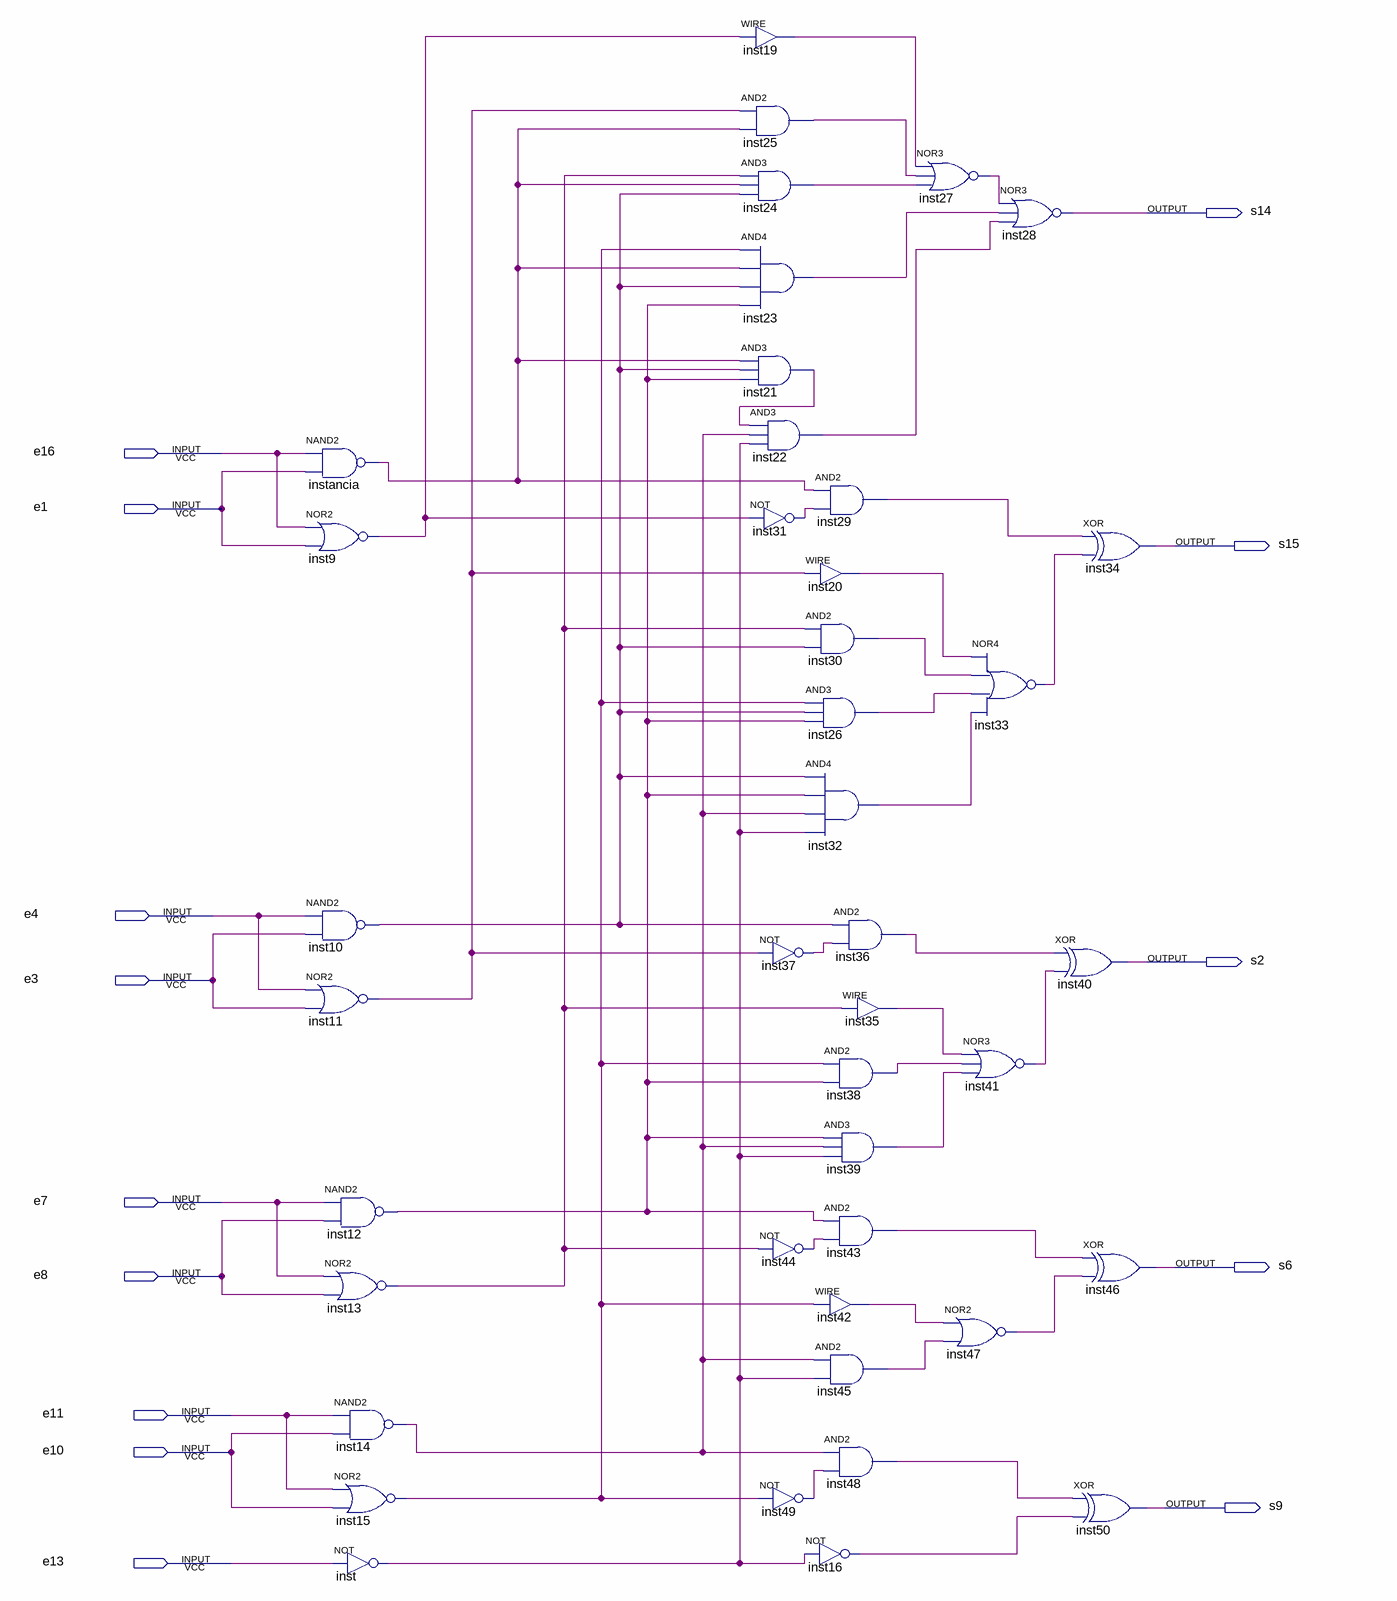
[diagram p0: schematic sheet]
// Quartus schematic Ci74LS83.bdf as structural Verilog: 42 symbols, 14 pins
module Ci74LS83 (
  input  e16,
  input  e1,
  input  e4,
  input  e3,
  input  e7,
  input  e8,
  input  e11,
  input  e10,
  input  e13,
  output s14,
  output s15,
  output s2,
  output s6,
  output s9
);

  wire inst9_out, inst10_out, inst11_out, inst12_out, inst13_out, inst14_out, inst15_out, inst16_out,
       inst19_out, inst20_out, inst21_out, inst22_out, inst23_out, inst24_out, inst25_out, inst26_out,
       inst27_out, inst29_out, inst30_out, inst31_out, inst32_out, inst33_out, inst35_out, inst36_out,
       inst37_out, inst38_out, inst39_out, inst41_out, inst42_out, inst43_out, inst44_out, inst45_out,
       inst47_out, inst48_out, inst49_out, inst_out, instancia_out;

  nand instancia (instancia_out, e16, e1);
  nor inst9 (inst9_out, e16, e1);
  nand inst10 (inst10_out, e4, e3);
  nor inst11 (inst11_out, e4, e3);
  nand inst12 (inst12_out, e7, e8);
  nor inst13 (inst13_out, e7, e8);
  nand inst14 (inst14_out, e11, e10);
  nor inst15 (inst15_out, e11, e10);
  not inst (inst_out, e13);
  assign inst19_out = inst9_out;  // WIRE inst19
  and inst25 (inst25_out, inst11_out, instancia_out);
  and inst24 (inst24_out, inst13_out, instancia_out, inst10_out);
  and inst23 (inst23_out, inst15_out, instancia_out, inst10_out, inst12_out);
  and inst21 (inst21_out, instancia_out, inst10_out, inst12_out);
  and inst22 (inst22_out, inst21_out, inst14_out, inst_out);
  not inst31 (inst31_out, inst9_out);
  not inst37 (inst37_out, inst11_out);
  not inst44 (inst44_out, inst13_out);
  not inst49 (inst49_out, inst15_out);
  and inst29 (inst29_out, instancia_out, inst31_out);
  assign inst20_out = inst11_out;  // WIRE inst20
  and inst30 (inst30_out, inst13_out, inst10_out);
  and inst26 (inst26_out, inst15_out, inst10_out, inst12_out);
  and inst32 (inst32_out, inst10_out, inst12_out, inst14_out, inst_out);
  and inst36 (inst36_out, inst10_out, inst37_out);
  and inst38 (inst38_out, inst15_out, inst12_out);
  and inst39 (inst39_out, inst12_out, inst14_out, inst_out);
  and inst43 (inst43_out, inst12_out, inst44_out);
  assign inst42_out = inst15_out;  // WIRE inst42
  and inst45 (inst45_out, inst14_out, inst_out);
  and inst48 (inst48_out, inst14_out, inst49_out);
  not inst16 (inst16_out, inst_out);
  assign inst35_out = inst13_out;  // WIRE inst35
  nor inst27 (inst27_out, inst19_out, inst25_out, inst24_out);
  nor inst33 (inst33_out, inst20_out, inst30_out, inst26_out, inst32_out);
  nor inst41 (inst41_out, inst35_out, inst38_out, inst39_out);
  nor inst47 (inst47_out, inst42_out, inst45_out);
  nor inst28 (s14, inst27_out, inst23_out, inst22_out);
  xor inst40 (s2, inst36_out, inst41_out);
  xor inst34 (s15, inst29_out, inst33_out);
  xor inst46 (s6, inst43_out, inst47_out);
  xor inst50 (s9, inst48_out, inst16_out);
endmodule
